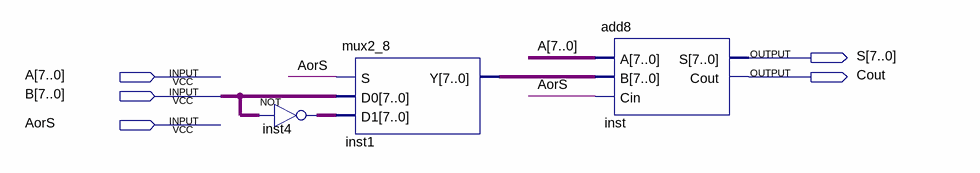
[diagram p0: schematic sheet]
// Quartus schematic AorS.bdf as structural Verilog: 3 symbols, 5 pins
module AorS (
  input  [7:0] A,
  input  [7:0] B,
  input  AorS,
  output [7:0] S,
  output Cout
);

  wire [7:0] inst1_y, inst4_out;

  assign inst4_out = ~B;  // NOT inst4, 8 bits wide
  mux2_8 inst1 (.S(AorS), .D0(B), .D1(inst4_out), .Y(inst1_y));
  add8 inst (.A(A), .B(inst1_y), .Cin(AorS), .S(S), .Cout(Cout));
endmodule
